# Altium schematic sheet Si5395_CLK_GEN.SchDoc
size 594 x 420 mm
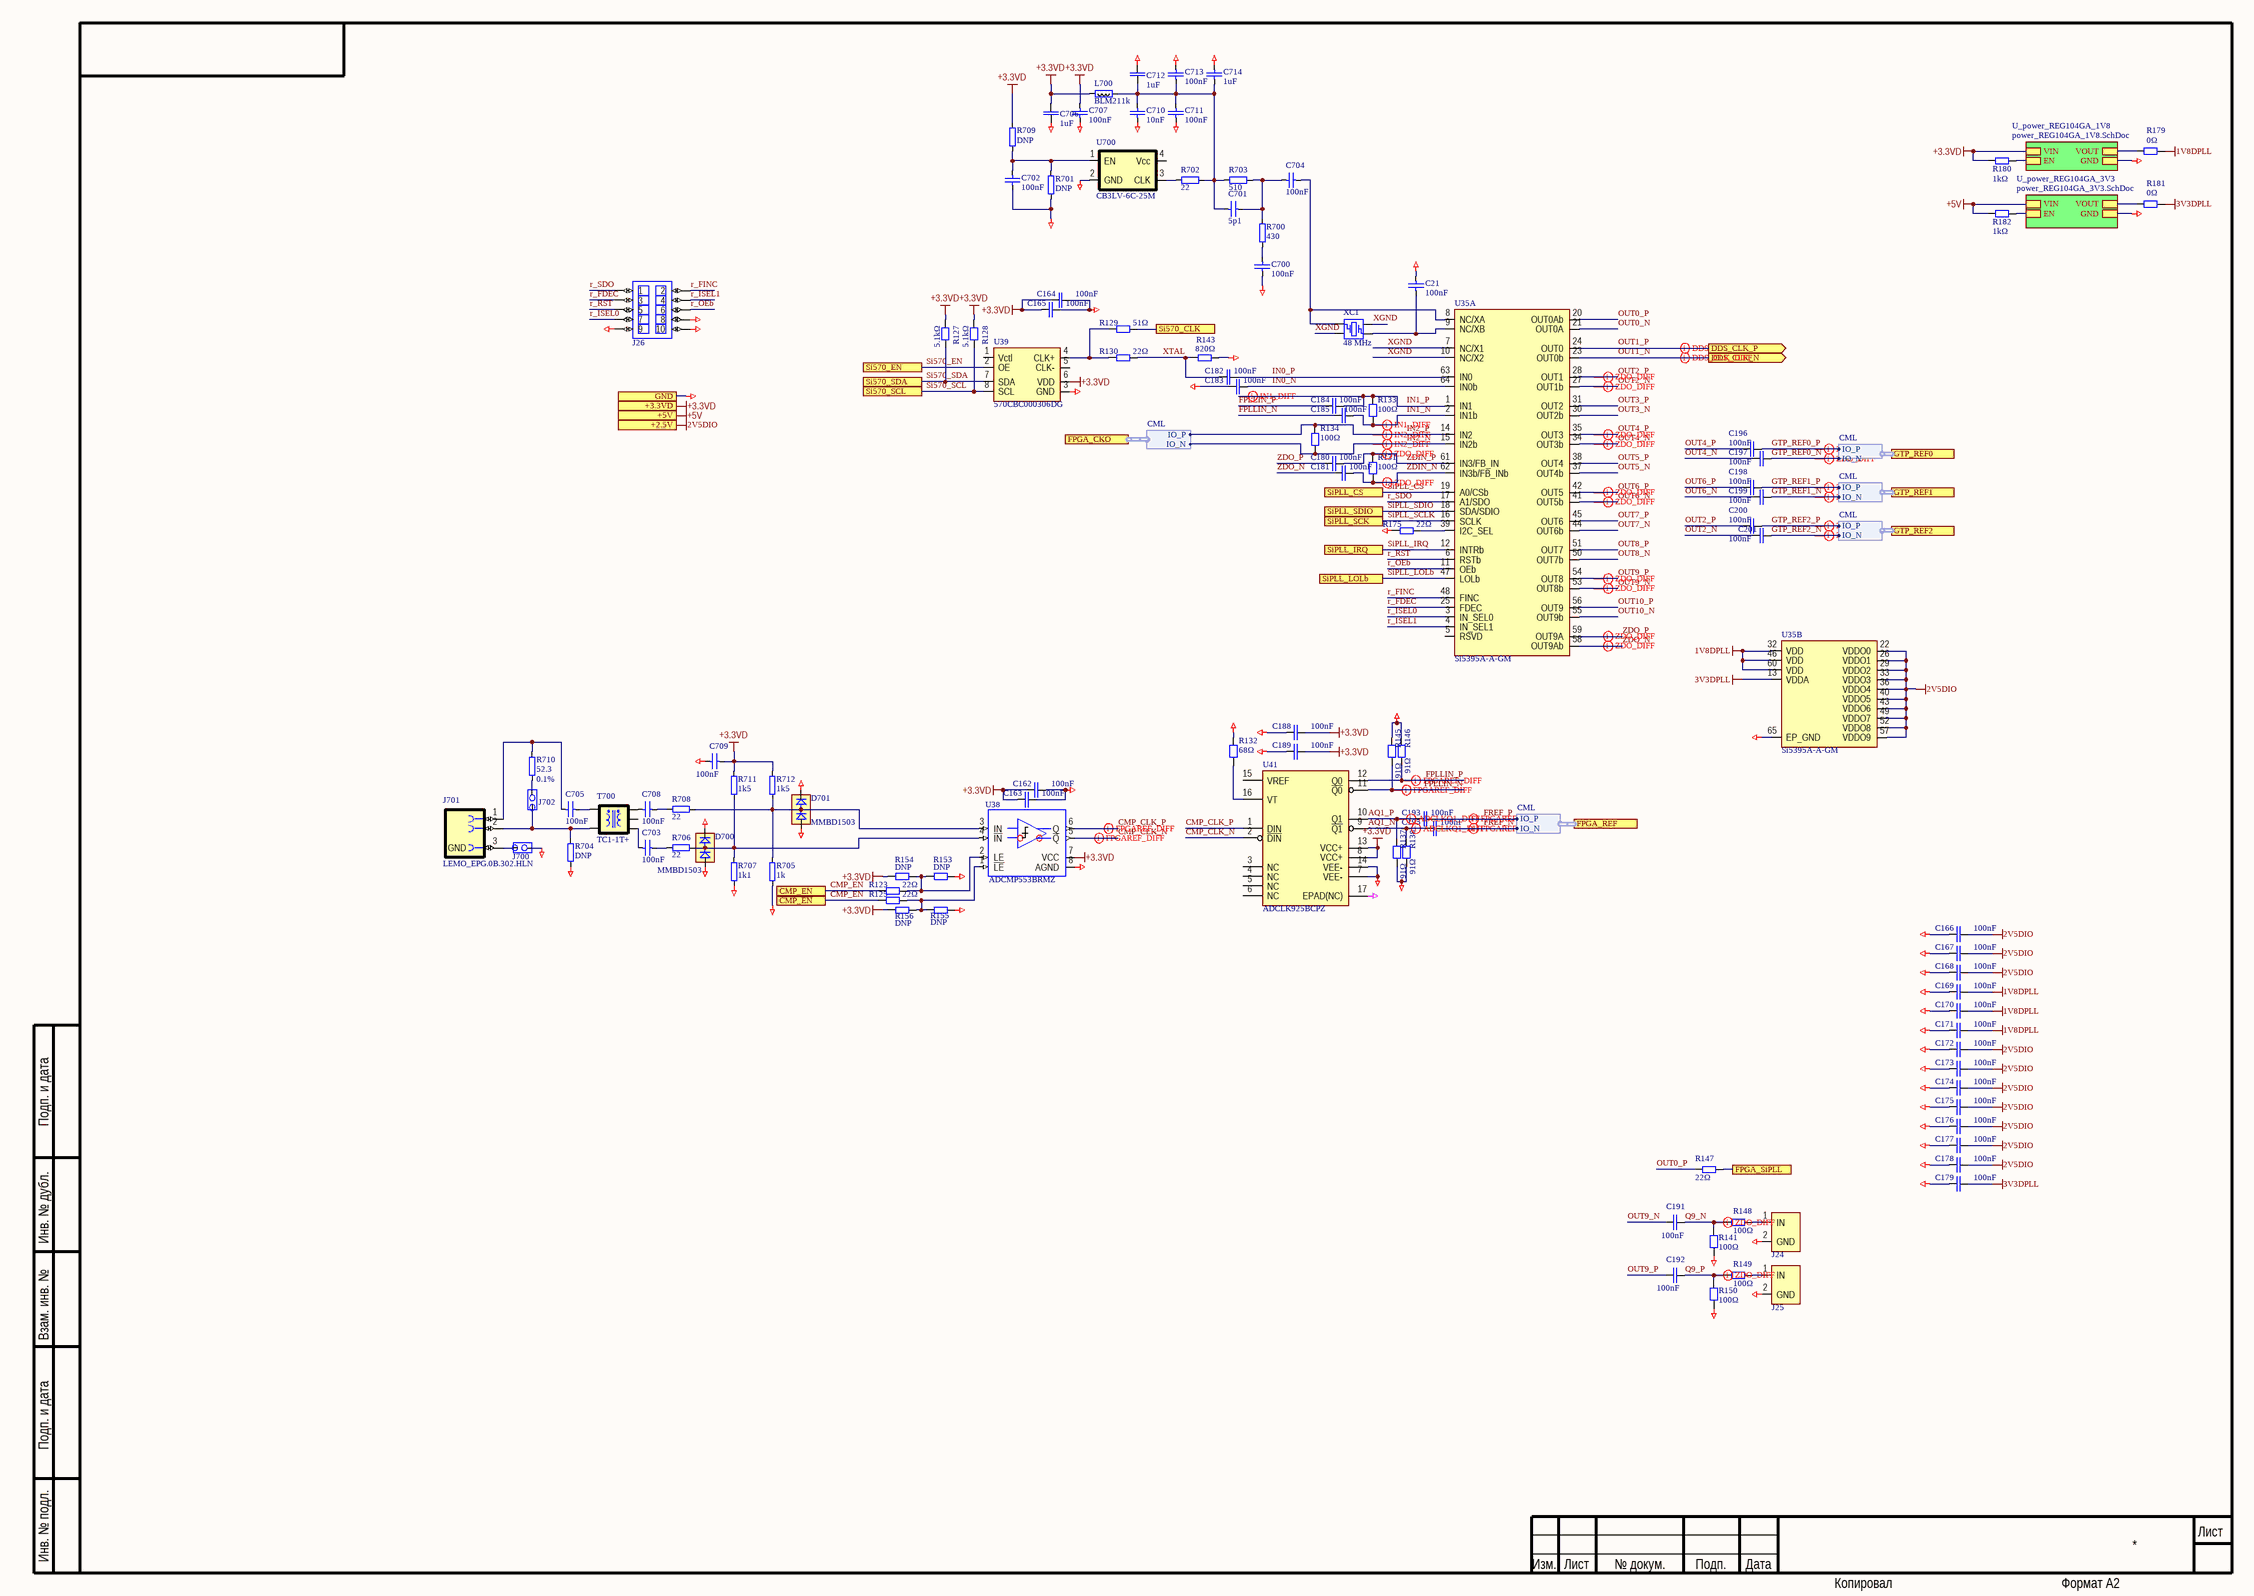
[diagram p0: Si5395_CLK_GEN.SchDoc]

## Parts
C21  100nF  [CAPC1608X87N]
C162  100nF  [CAPC1608N]
C163  100nF  [CAPC1608N]
C164  100nF  [CAPC1608N]
C165  100nF  [CAPC1608N]
C166  100nF  [CAPC1608N]
C167  100nF  [CAPC1608N]
C168  100nF  [CAPC1608N]
C169  100nF  [CAPC1608N]
C170  100nF  [CAPC1608N]
C171  100nF  [CAPC1608N]
C172  100nF  [CAPC1608N]
C173  100nF  [CAPC1608N]
C174  100nF  [CAPC1608N]
C175  100nF  [CAPC1608N]
C176  100nF  [CAPC1608N]
C177  100nF  [CAPC1608N]
C178  100nF  [CAPC1608N]
C179  100nF  [CAPC1608N]
C180  100nF  [CAPC1608N]
C181  100nF  [CAPC1608N]
C182  100nF  [CAPC1608N]
C183  100nF  [CAPC1608N]
C184  100nF  [CAPC1608N]
C185  100nF  [CAPC1608N]
C188  100nF  [CAPC1608N]
C189  100nF  [CAPC1608N]
C191  100nF  [CAPC1608N]
C192  100nF  [CAPC1608N]
C193  100nF  [CAPC1608N]
C195  100nF  [CAPC1608N]
C196  100nF  [CAPC1608N]
C197  100nF  [CAPC1608N]
C198  100nF  [CAPC1608N]
C199  100nF  [CAPC1608N]
C200  100nF  [CAPC1608N]
C201  100nF  [CAPC1608N]
C700  100nF  [CAPC1608X87N]
C701  5p1  [CAPC1608X87N]
C702  100nF  [CAPC1608X87N]
C703  100nF  [SMD0805CAP]
C704  100nF  [CAPC1608X87N]
C705  100nF  [SMD0805CAP]
C706  1uF  [0508]
C707  100nF  [CAPC1608X87N]
C708  100nF  [SMD0805CAP]
C709  100nF  [SMD0805CAP]
C710  10nF  [CAPC1608X87N]
C711  100nF  [CAPC1608X87N]
C712  1uF  [0508]
C713  100nF  [SMD0805CAP]
C714  1uF  [SMD0805CAP]
D700  MMBD1503  [SOT95P280X115-3N]
D701  MMBD1503  [SOT95P280X115-3N]
J24  DNP  [LEMO_EPA.00.250.NTN]  (value not drawn)
J25  DNP  [LEMO_EPA.00.250.NTN]  (value not drawn)
J26  DNP  [PLD-10]  (value not drawn)
J700  PLS-2  [PLS-2]  (value not drawn)
J701  LEMO_EPG.0B.302.HLN  [LEMO_EPG.0B.302.HLN]
J702  PLS-2  [PLS-2]  (value not drawn)
L700  BLM211k  [RESC2012X50N]
R123  22Ω  [RESC1608N]
R125  22Ω  [RESC1608N]
R127  5.1kΩ  [RESC2012N]
R128  5.1kΩ  [RESC2012N]
R129  51Ω  [RESC2012N]
R130  22Ω  [RESC1608N]
R131  100Ω  [RESC1608N]
R132  68Ω  [RESC1608N]
R133  100Ω  [RESC1608N]
R134  100Ω  [RESC1608N]
R137  91Ω  [RESC1608N]
R138  91Ω  [RESC1608N]
R141  100Ω  [RESC1608N]
R143  820Ω  [RESC1608N]
R145  91Ω  [RESC1608N]
R146  91Ω  [RESC1608N]
R147  22Ω  [RESC1608N]
R148  100Ω  [RESC1608N]
R149  100Ω  [RESC1608N]
R150  100Ω  [RESC1608N]
R153  DNP  [RESC1608N]
R154  DNP  [RESC1608N]
R155  DNP  [RESC1608N]
R156  DNP  [RESC1608N]
R175  22Ω  [RESC1608N]
R179  0Ω  [RESC2012N]
R180  1kΩ  [RESC2012N]
R181  0Ω  [RESC2012N]
R182  1kΩ  [RESC2012N]
R700  430  [SMD0805RES]
R701  DNP  [SMD0805RES]
R702  22  [SMD0805RES]
R703  510  [SMD0805RES]
R704  DNP  [SMD0805RES]
R705  1k  [SMD0805RES]
R706  22  [SMD0805RES]
R707  1k1  [SMD0805RES]
R708  22  [SMD0805RES]
R709  DNP  [SMD0805RES]
R710  52.3  Tolerance: 0.1%  [SMD0805RES]
R711  1k5  [SMD0805RES]
R712  1k5  [SMD0805RES]
T700  TC1-1T+  [XFMR_MINI-CIRCUITS_AT224]
U35  Si5395A-A-GM  [QFN50P900X900X100-65N-S530]  (parts A,B of 2)
U38  ADCMP553BRMZ  [SOP65P490X110-8N]
U39  570CBC000306DG  [FP-57x-MFG]
U41  ADCLK925BCPZ  [QFN50P300X300X100-17N-S150]
U700  CB3LV-6C-25M  [OSCSC508P500X700X160-4N]
XC1  value 48 MHz  [SMD3225_4PIN_XTAL]  (hidden comment: CX3225SB48000D0WPSC1)

## Sub-sheets
U_power_REG104GA_1V8 = power_REG104GA_1V8.SchDoc: GND, VOUT, VIN, EN
U_power_REG104GA_3V3 = power_REG104GA_3V3.SchDoc: GND, VOUT, VIN, EN

## Ports
+2.5V, +3.3VD, +5V, CMP_EN, DDS_CLK_N (out), DDS_CLK_P (out), FPGA_CKO (harness CML), FPGA_REF (harness CML), FPGA_SiPLL, GND, GTP_REF0 (harness CML), GTP_REF1 (harness CML), GTP_REF2 (harness CML), Si570_CLK, Si570_EN, Si570_SCL, Si570_SDA, SiPLL_CS, SiPLL_IRQ, SiPLL_LOLb, SiPLL_SCK, SiPLL_SDIO, ~{CMP_EN}

## Harnesses
CML: IO_N, IO_P

## Nets
1V8DPLL: C169.2 C170.2 C171.2 R179.1 U35.32(VDD) U35.46(VDD) U35.60(VDD)
2V5DIO: C166.2 C167.2 C168.2 C172.2 C173.2 C174.2 C175.2 C176.2 C177.2 C178.2 U35.22(VDDO0) U35.26(VDDO1) U35.29(VDDO2) U35.33(VDDO3) U35.36(VDDO4) U35.40(VDDO5) U35.43(VDDO6) U35.49(VDDO7) U35.52(VDDO8) U35.57(VDDO9) ; port +2.5V
3V3DPLL: C179.2 R181.1 U35.13(VDDA)
+3.3VD: C162.1 C163.1 C164.1 C165.1 C188.2 C189.2 C706.1 C707.2 C709.1 L700.1 R127.1 R128.1 R154.1 R156.1 R180.2 R709.2 R711.2 R712.2 U38.7(VCC) U39.6(VDD) U41.8(VCC+) U41.13(VCC+) ; port +3.3VD, sheet U_power_REG104GA_1V8/VIN
+5V: R182.2 ; port +5V, sheet U_power_REG104GA_3V3/VIN
GEPAD: U41.17(EPAD(NC))
GND: C21.2 C162.2 C163.2 C164.2 C165.2 C166.1 C167.1 C168.1 C169.1 C170.1 C171.1 C172.1 C173.1 C174.1 C175.1 C176.1 C177.1 C178.1 C179.1 C183.1 C188.1 C189.1 C700.1 C702.1 C706.2 C707.1 C709.2 C710.1 C711.1 C712.2 C713.1 C714.1 D700.1 D700.2 D701.1 D701.2 J24.2(GND) J25.2(GND) J26.8 J26.9 J26.10 J700.2 R132.2 R137.1 R138.1 R141.1 R143.2 R145.2 R146.2 R150.1 R153.2 R155.2 R175.1 R701.1 R704.1 R705.1 R707.1 U35.65(EP_GND) U38.8(AGND) U39.3(GND) U41.7(VEE-) U41.14(VEE-) U700.2(GND) ; port GND, sheet U_power_REG104GA_1V8/GND, sheet U_power_REG104GA_3V3/GND
AQ1_N: C195.1 R138.2 U41.9(~{Q1})
AQ1_P: C193.1 R137.2 U41.10(Q1)
~{CMP_EN}: R125.1 ; port ~{CMP_EN}
CMP_CLK_N: U38.5(~{Q}) U41.2(~{DIN})
CMP_CLK_P: U38.6(Q) U41.1(DIN)
CMP_EN: R123.1 ; port CMP_EN
FPGA_SiPLL: R147.2 ; port FPGA_SiPLL
FPLLIN_N: C185.1 R145.1 U41.11(~{Q0})
FPLLIN_P: C184.1 R146.1 U41.12(Q0)
FREF_N: C195.2 ; port FPGA_REF.IO_N
FREF_P: C193.2 ; port FPGA_REF.IO_P
GTP_REF0_N: C197.2 ; port GTP_REF0.IO_N
GTP_REF0_P: C196.2 ; port GTP_REF0.IO_P
GTP_REF1_N: C199.2 ; port GTP_REF1.IO_N
GTP_REF1_P: C198.2 ; port GTP_REF1.IO_P
GTP_REF2_N: C201.2 ; port GTP_REF2.IO_N
GTP_REF2_P: C200.2 ; port GTP_REF2.IO_P
IN0_N: C183.2 U35.64(IN0b)
IN0_P: C182.2 U35.63(IN0)
IN1_N: C185.2 R133.1 U35.2(IN1b)
IN1_P: C184.2 R133.2 U35.1(IN1)
IN2_N: R134.1 U35.15(IN2b) ; port FPGA_CKO.IO_N
IN2_P: R134.2 U35.14(IN2) ; port FPGA_CKO.IO_P
OUT0_N: U35.21(OUT0A)
OUT0_P: R147.1 U35.20(OUT0Ab)
OUT1_N: U35.23(OUT0b) ; port DDS_CLK_N
OUT1_P: U35.24(OUT0) ; port DDS_CLK_P
OUT2_N: C201.1 U35.27(OUT1b)
OUT2_P: C200.1 U35.28(OUT1)
OUT3_N: U35.30(OUT2b)
OUT3_P: U35.31(OUT2)
OUT4_N: C197.1 U35.34(OUT3b)
OUT4_P: C196.1 U35.35(OUT3)
OUT5_N: U35.37(OUT4b)
OUT5_P: U35.38(OUT4)
OUT6_N: C199.1 U35.41(OUT5b)
OUT6_P: C198.1 U35.42(OUT5)
OUT7_N: U35.44(OUT6b)
OUT7_P: U35.45(OUT6)
OUT8_N: U35.50(OUT7b)
OUT8_P: U35.51(OUT7)
OUT9_N: C191.1 U35.53(OUT8b)
OUT9_P: C192.1 U35.54(OUT8)
OUT10_N: U35.55(OUT9b)
OUT10_P: U35.56(OUT9)
Q9_N: C191.2 R141.2 R148.1
Q9_P: C192.2 R149.1 R150.2
r_FDEC: J26.3 U35.25(FDEC)
r_FINC: J26.2 U35.48(FINC)
r_ISEL0: J26.7 U35.3(IN_SEL0)
r_ISEL1: J26.4 U35.4(IN_SEL1)
r_OEb: J26.6 U35.11(OEb)
r_RST: J26.5 U35.6(RSTb)
r_SDO: J26.1 U35.17(A1/SDO)
Si570_CLK: R129.2 ; port Si570_CLK
Si570_EN: U39.2(OE) ; port Si570_EN
Si570_SCL: R128.2 U39.8(SCL) ; port Si570_SCL
Si570_SDA: R127.2 U39.7(SDA) ; port Si570_SDA
SiPLL_CS: U35.19(A0/CSb) ; port SiPLL_CS
SiPLL_IRQ: U35.12(INTRb) ; port SiPLL_IRQ
SiPLL_LOLb: U35.47(LOLb) ; port SiPLL_LOLb
SiPLL_SCLK: U35.16(SCLK) ; port SiPLL_SCK
SiPLL_SDIO: U35.18(SDA/SDIO) ; port SiPLL_SDIO
XGND: U35.7(NC/X1) U35.10(NC/X2) XC1.2(SLD) XC1.4(SLD)
XTAL: C182.1 R130.2 R143.1
ZDIN_N: C181.2 R131.1 U35.62(IN3b/FB_INb)
ZDIN_P: C180.2 R131.2 U35.61(IN3/FB_IN)
ZDO_N: C181.1 U35.58(OUT9Ab)
ZDO_P: C180.1 U35.59(OUT9A)
NetC21_1: C21.1 U35.9(NC/XB) XC1.3(XTAL-)
NetC700_2: C700.2 R700.2
NetC701_1: C701.1 C704.2 R700.1 R703.1
NetC701_2: C701.2 C710.2 C711.2 C712.1 C713.2 C714.2 L700.2 R702.1 R703.2
NetC702_2: C702.2 R701.2 R709.1 U700.1(EN)
NetC703_1: C703.1 T700.1
NetC703_2: C703.2 R706.2
NetC704_1: C704.1 U35.8(NC/XA) XC1.1(XTAL+)
NetC705_1: C705.1 J701.1 R710.2
NetC705_2: C705.2 T700.4
NetC708_1: C708.1 T700.3
NetC708_2: C708.2 R708.2
NetD700_3: D700.3 R706.1 R707.2 R711.1 U38.4(~{IN})
NetD701_3: D701.3 R705.2 R708.1 R712.1 U38.3(IN)
NetJ24_1: J24.1(IN) R148.2
NetJ25_1: J25.1(IN) R149.2
NetJ700_1: J700.1 J701.3(GND)
NetJ701_2: J701.2 J702.1 R704.2 T700.6
NetJ702_2: J702.2 R710.1
NetR123_2: R123.2 R153.1 R154.2 U38.2(LE)
NetR125_2: R125.2 R155.1 R156.2 U38.1(~{LE})
NetR129_1: R129.1 R130.1 U39.4(CLK+)
NetR132_1: R132.1 U41.16(VT)
NetR175_2: R175.2 U35.39(I2C_SEL)
NetR179_2: R179.2 ; sheet U_power_REG104GA_1V8/VOUT
NetR180_1: R180.1 ; sheet U_power_REG104GA_1V8/EN
NetR181_2: R181.2 ; sheet U_power_REG104GA_3V3/VOUT
NetR182_1: R182.1 ; sheet U_power_REG104GA_3V3/EN
NetR702_2: R702.2 U700.3(CLK)

Not connected (* = marked no-connect by the designer): T700 2; U35 5(RSVD); U39 1(Vctl) 5(CLK-); U41 3(NC) 4(NC) 5(NC) 6(NC) 15(VREF); U700 4(Vcc)

## Layout directives
differential pair; rule Differential Pairs Routing [Pref Gap = 0.175mm    Min Gap  = 0.075mm    Max Gap  = 0.5mmPref Width = 0.15mm    Min Width  = 0.075mm    Max Width  = 0.5mm]: IN1_N, IN1_P, IN2_N, IN2_P, OUT2_N, OUT2_P, OUT4_N, OUT4_P, OUT6_N, OUT6_P, OUT9_N, OUT9_P, Q9_N, Q9_P, ZDIN_N, ZDIN_P, ZDO_N, ZDO_P
differential pair; rule Differential Pairs Routing [Pref Gap = 0.175mm    Min Gap  = 0.075mm    Max Gap  = 0.5mmPref Width = 0.25mm    Min Width  = 0.075mm    Max Width  = 0.5mm]: AQ1_N, AQ1_P, CMP_CLK_N, CMP_CLK_P, FPLLIN_N, FPLLIN_P, FREF_N, FREF_P, OUT1_N, OUT1_P
differential pair; rule Differential Pairs Routing [Pref Gap = 0.4mm    Min Gap  = 0.075mm    Max Gap  = 0.5mmPref Width = 0.3mm    Min Width  = 0.075mm    Max Width  = 0.5mm]: GTP_REF0_N, GTP_REF0_P, GTP_REF1_N, GTP_REF1_P, GTP_REF2_N, GTP_REF2_P

## Notes on the sheet
- Подп. и дата
- Инв. № дубл.
- Взам. инв. №
- Инв. № подл.
- Изм.
- Лист
- № докум.
- Подп.
- Дата
- Копировал
- Формат А2

## Library data of the parts
C21 C700-C702 C704 C707 C710 C711 = C0603: Чип конденсатор 0603; Voltage: 50V; Vendor: Vishay; DielectricType: X5R; SMD Solders: 2; Solder Option: RM; Tolerance: 20%; Pkg: SMD0603; Device: Cap603; Price: 2
  C21 C700 C702 C704 C707 C711: Value: 100nF
  C701: Value: 5p1
  C710: Value: 10nF
C162-C185 C188 C189 C191-C193 C195-C201 = CAPC: Generic ceramic SMD capacitor; Pkg: 0603; Maintainer: Evgeniy Kotov; SMD Solders: 2; THD Solders: 0; PartField: 100nF; Last Change Data: 06.03.2017; Release Date: 06.03.2017; Value: 100nF
C703 C705 C708 C709 = C0805: Чип конденсатор 0805; Voltage: 50V; Vendor: Vishay; DielectricType: X5R; SMD Solders: 2; Solder Option: RM; Tolerance: 20%; Pkg: SMD0805; Device: Cap0805; Value: 100nF; Price: 2
C706 C712 = CAP_LLL219R71A105: 1uF; 10V; 0805R; X7R; Low ESL; Reverse geometry; Vendor: muRata; SolderOption: 2; THD Solders: 0; PartField: LLL219R71A105; Pkg: 0508; Value: 1uF; SMD Solders: 2; ClassName: Soldered_BINP
C713 C714 = C0805: Чип конденсатор 0805; Voltage: 25V; Vendor: Vishay; DielectricType: X5R; SMD Solders: 2; Solder Option: RM; Tolerance: 20%; Pkg: SMD0805; Device: Cap0805; Price: 2
  C713: Value: 100nF
  C714: Value: 1uF
D700 D701 = MMBD1503: High Conductance Low Leakage Diode; SolderOption: 0; Pkg: SOT-3N; SMD Solders: 3; HelpURL: https://www.engineering.uiowa.edu/sites/default/files/ees/files/NI/pdfs/01/30/DS013013.pdf; Value: MMBD1503; PartField: MMBD1503; THD Solders: 0
J24 J25 = LEMO_EPA.00.250: PartField: EPA.00.250.NTN; SolderOption: 0; Pkg: LEMO 5pin; THD Solders: 5; Value: DNP; SMD Solders: 0
J26 = IDC-10MS: Connector, 5x2, Male, 2.54mm Pitch, Strait contacts, with Body; PartField: IDC-10MC; SMD Solders: 0; THD Solders: 10; Maintainer: Evgeniy Kotov; Pkg: IDC-10; Last Change Data: 28.03.2017; Release Date: 28.03.2017; Value: DNP; ComponentLink1Description: Datasheet
J700 J702 = PLS-2: Connector, 5x2, Male, 2.54mm Pitch, Right Angle; SMD Solders: 0; THD Solders: 2; Maintainer: Evgeniy Kotov; PartField: PLS-2; Last Change Data: 02.04.2017; Release Date: 02.04.2017; Value: PLS-2; ComponentLink1Description: Datasheet; Pkg: PLS-2
J701 = LEMO_EPG.0B.302.HLN: LEMO дифференциальный, угдовой; SMD Solders: 0; Solder Option: RM; THD Solders: 6; Price: 5000; Vendor: LEMO; Pkg: LEMO_EPG.0B.302.HLN; Device: LEMO_EPG.0B.302.HLN; Name to order: LEMO_EPG.0B.302.HLN
L700 = BLM21: SMD Ferrite bead 0805; Vendor: Vishay; Value: 1k; Pkg: SMD0805; SMD Solders: 2; Solder Option: RM; Price: 10; Device: BLM21
R123 R125 R130-R134 R137 R138 R141 R143 R145-R150 R175 = RESC: Resistor, Generic, SMD; Pkg: 0603; Maintainer: Evgeniy Kotov; SMD Solders: 2; THD Solders: 0; Release Date: 06.03.2017; Last Change Data: 09.03.2017
  R123 R125 R130 R147 R175: PartField: 22Ω; Value: 22Ω
  R131 R133 R134 R141 R148-R150: PartField: 100Ω; Value: 100Ω
  R132: PartField: 68Ω; Value: 68Ω
  R137 R138 R145 R146: PartField: 91Ω; Value: 91Ω
  R143: PartField: 820Ω; Value: 820Ω
R127-R129 R179 R181 = RESC: Resistor, Generic, SMD; Pkg: 0805; Maintainer: Evgeniy Kotov; SMD Solders: 2; THD Solders: 0; Release Date: 06.03.2017; Last Change Data: 09.03.2017
  R127 R128: PartField: 5.1kΩ; Value: 5.1kΩ
  R129: PartField: 51Ω; Value: 51Ω
  R179 R181: PartField: 0Ω; Value: 0Ω
R153-R156 = RESC: Resistor, Generic, SMD; PartField: *Ω; Pkg: 0603; Maintainer: Evgeniy Kotov; SMD Solders: 2; THD Solders: 0; Release Date: 06.03.2017; Last Change Data: 09.03.2017; Value: DNP
R180 R182 = RESC: Resistor, Generic, SMD; PartField: 150Ω; Pkg: 0805; Maintainer: Evgeniy Kotov; SMD Solders: 2; THD Solders: 0; Release Date: 06.03.2017; Last Change Data: 09.03.2017; Value: 1kΩ
R700 R702 R703 R706 R708 = R0805: Чип резистор 0805; Vendor: Vishay; SMD Solders: 2; Solder Option: RM; TC: 100ppm/C; Tolerance: 1%; Pkg: SMD0805; Pwr: 125mW; Device: Res0805; Price: 2
  R700: Value: 430
  R702 R706 R708: Value: 22
  R703: Value: 510
R701 R704 R705 R707 R709 R711 R712 = R0805: Чип резистор 0805; Vendor: Vishay; SMD Solders: 2; Solder Option: i; TC: 100ppm/C; Tolerance: 1%; Pkg: SMD0805; Pwr: 125mW; Device: Res0805; Price: 2
  R701 R704 R709: Value: DNP
  R705: Value: 1k
  R707: Value: 1k1
  R711 R712: Value: 1k5
R710 = R0805: Чип резистор 0805; Vendor: Vishay; SMD Solders: 2; Solder Option: RM; TC: 100ppm/C; Pkg: SMD0805; Pwr: 125mW; Device: Res0805; Price: 2; Value: 52.3
T700 = TC1-1T+: RF Transformer; 50Ω; 1.5 to 500 MHz; Impedance Ratio=1; Vendor: Texas Instruments; Value: 1:1; Pkg: AT1521; SMD Solders: 5; Solder Option: RM; THD Solders: 0; Price: 1000; Device: TC1-1T+; Name to order: TC1-1T+
U35 = Si5395A: Manufacturer: SiLabs; SMD Solders: 65; THD Solders: 0; Pkg: QFN-64EP; PartField: Si5395A-A-GM; Value: Si5395A; Vendor: SiLabs
U38 = ADCMP553BRMZ: LVDS Comparator; Vendor: Analog Devices Inc; SolderOption: 0; Pkg: MSOP-8; SMD Solders: 8; Manufacturer_Part_Number: ADCMP553BRMZ; Value: ADCMP553BRMZ; PartField: ADCMP553BRMZ; THD Solders: 0
U39 = Si570: XTAL OSCILLATOR SMD; Manufacturer: Silicon Labs; Manufacturer Part Number: 541AAA001040BAGR; Min Supply Voltage: 2.375V; Max Supply Voltage: 3.465V; Pkg: SMD 6pin; Frequency: 0.2-1500MHz; Nominal Supply Current: 100mA; Maintainer: Evgeniy Kotov; SMD Solders: 6; THD Solders: 0; Value: Si570; Device Class L2: Clock and Timing; ComponentLink2Description: Datasheet; RoHS: TRUE; Device Class L1: Integrated Circuits (ICs); Height: 1.33mm; Octopart: https://octopart.com/541aaa001040bagr-silicon+labs-103392146; ComponentLink2URL: https://www.silabs.com/documents/public/data-sheets/si541-datasheet.pdf; Temperature Range High: +85°C; Category: IC; Ambient Temperature Range High: +85°C; Digikey Description: XTAL OSCILLATOR SMD; Lead Free: Yes; Ambient Temperature Range Low: -40°C; Device Class L3: Timers and Oscillators; Automotive: No; Temperature: -40°C to +85°C; Temperature Range Low: -40°C; Last Change Data: 09.03.2017; PartField: 570CBC000306DG
U41 = ADCLK925BCPZ: IC CLK FANOUT BUFFER 1:2 16LFCSP; Manufacturer: Silicon Labs; Number Of Inputs: 2; Standoff Height: 0mm; Number Of Outputs: 4; Pkg: LFCSP-16EP; Max Junction Temp: +125°C; Min Supply Voltage: 1.71V; Number Of Elements: 1; Nominal Supply Current: 65mA; Max Supply Voltage: 3.63V; Logic Function: Non-Inverting; Propagation Delay: 875ps; Maintainer: Evgeniy Kotov; SMD Solders: 17; THD Solders: 0; Manufacturer Part Number: ADCLK925BCPZ; Ambient Temperature Range High: +85°C; Device Class L2: Clock and Timing; Temperature: -40°C to +85°C; Automotive: No; Height: 0.9mm; ComponentLink2URL: https://www.silabs.com/documents/public/data-sheets/si5330x-datasheet.pdf; ComponentLink2Description: Datasheet; Temperature Range High: +85°C; Category: IC; Ambient Temperature Range Low: -40°C; Device Class L1: Integrated Circuits (ICs); Octopart: https://octopart.com/si53307-b-gm-silicon+labs-51374320; Mouser Description: Clock Buffer 1:2 Univ bufr/Lvl Trans 725MHz; Temperature Range Low: -40°C; Device Class L3: Clock Buffers; Ipc Land Pattern Name: QFN50P300X300X85-16; RoHS: TRUE; Digikey Description: IC CLK BUFFER 2:4 725MHZ 16QFN; Lead Free: Yes; PartField: ADCLK925BCPZ; Last Change Data: 09.03.2017; Value: ADCLK925BCPZ
U700 = CB3LV: Clock generator; Vendor: CTS Electronic Components; Pkg: 7x5mm; SMD Solders: 4; Solder Option: RM; THD Solders: 0; Current: 60; Value: -6C-25M; Price: 1000; Device: CB3LV; Name to order: CB3LV-6C-25M
XC1 = XTAL_CX3225SB48: Kyocera XTAL 48MHz CX3225SB48000D0WPSC1; Pkg: 4 pin SMD; Maintainer: Evgeniy Kotov; SMD Solders: 4; THD Solders: 0; PartField: CX3225SB48000D0WPSC1; Vendor: Kyocera; Release Date: 06.03.2017; Last Change Data: 09.03.2017